# Altium project Harness_Demo_PCB_A.PrjPcb
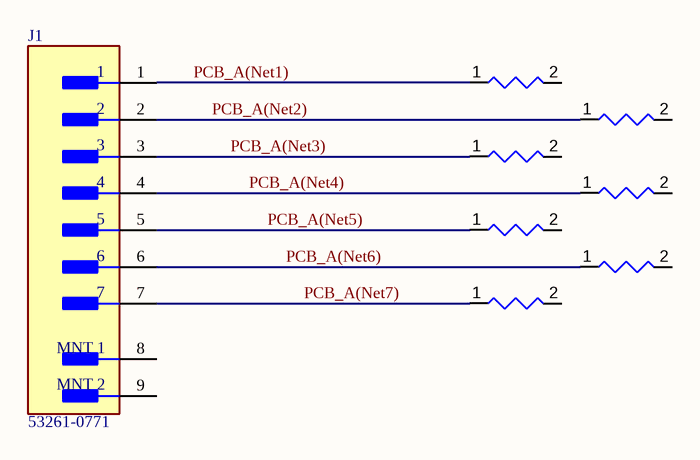
[diagram p0: Sheet2.SchDoc]
1 sheet, 8 parts. Net scope: global (net labels, ports and power ports of the same name join across sheets).

## Sheet Sheet2.SchDoc
size A4; SheetNumber: 1; SheetTotal: 1

### Parts
J1  53261-0771  [FP-53261-0771-MFG]
R1  Resistor 10k +/-1% 1206 250 mW  [RESC3216X60X45ML15T20]  (value not drawn)
R2  Resistor 10k +/-1% 1206 250 mW  [RESC3216X60X45ML15T20]  (value not drawn)
R3  Resistor 10k +/-1% 1206 250 mW  [RESC3216X60X45ML15T20]  (value not drawn)
R4  Resistor 10k +/-1% 1206 250 mW  [RESC3216X60X45ML15T20]  (value not drawn)
R5  Resistor 10k +/-1% 1206 250 mW  [RESC3216X60X45ML15T20]  (value not drawn)
R6  Resistor 10k +/-1% 1206 250 mW  [RESC3216X60X45ML15T20]  (value not drawn)
R7  Resistor 10k +/-1% 1206 250 mW  [RESC3216X60X45ML15T20]  (value not drawn)

### Nets
PCB_A(Net1): J1.1 R1.1
PCB_A(Net2): J1.2 R2.1
PCB_A(Net3): J1.3 R3.1
PCB_A(Net4): J1.4 R4.1
PCB_A(Net5): J1.5 R5.1
PCB_A(Net6): J1.6 R6.1
PCB_A(Net7): J1.7 R7.1

Not connected (* = marked no-connect by the designer): J1 8(MNT_1) 9(MNT_2); R1 2; R2 2; R3 2; R4 2; R5 2; R6 2; R7 2

### Library data of the parts
J1 = CMP-002-00075-1: Board Connector, 7 Contact(s), 1 Row(s), Male, Right Angle, 0.049 inch Pitch, Surface Mount Terminal, Locking, Natural Insulator, Receptacle; Manufacturer: Molex; System: Connector; Manufacturer Part Number: 53261-0771; Component Type: Connectors
R1-R7 = CMP-009-00016-5: Chip Resistor, 10 KOhm, +/- 1%, 0.25 W, -55 to 155 degC, 1206 (3216 Metric); Power: 250mW; Voltage Rating: 200V; Pins: 2; Max Operating Temperature: 155°C; Tolerance: 1%; Value: 10k; RoHS Compliant: True; Case/Package: 1206; Min Operating Temperature: -55°C; Mounting Technology: SM